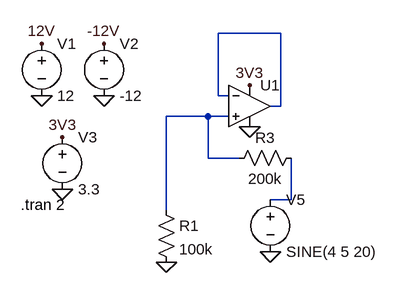
[diagram p0: schematic Draft1.asc]
Draft1.asc, the LTspice schematic file:
Version 4
SHEET 1 880 680
WIRE 288 32 192 32
WIRE 192 128 192 32
WIRE 208 128 192 128
WIRE 288 144 288 32
WIRE 288 144 272 144
WIRE 176 160 112 160
WIRE 208 160 176 160
WIRE 176 224 176 160
WIRE 224 224 176 224
WIRE 304 288 304 224
WIRE 304 288 272 288
WIRE 112 304 112 160
FLAG -80 128 0
FLAG 16 128 0
FLAG -48 272 0
FLAG -80 48 12V
FLAG 16 48 -12V
FLAG -48 192 3V3
FLAG 272 368 0
FLAG 112 384 0
FLAG 240 176 0
FLAG 240 112 3V3
SYMBOL voltage -80 32 R0
WINDOW 123 0 0 Left 0
WINDOW 39 0 0 Left 0
SYMATTR InstName V1
SYMATTR Value 12
SYMBOL voltage 16 32 R0
WINDOW 123 0 0 Left 0
WINDOW 39 0 0 Left 0
SYMATTR InstName V2
SYMATTR Value -12
SYMBOL voltage -48 176 R0
WINDOW 123 0 0 Left 0
WINDOW 39 0 0 Left 0
SYMATTR InstName V3
SYMATTR Value 3.3
SYMBOL Opamps\\UniversalOpamp2 240 144 R0
SYMATTR InstName U1
SYMBOL voltage 272 272 R0
WINDOW 123 0 0 Left 0
WINDOW 39 0 0 Left 0
SYMATTR InstName V5
SYMATTR Value SINE(4 5 20)
SYMBOL res 96 288 R0
SYMATTR InstName R1
SYMATTR Value 100k
SYMBOL res 320 208 R90
WINDOW 0 0 56 VBottom 2
WINDOW 3 32 56 VTop 2
SYMATTR InstName R3
SYMATTR Value 200k
TEXT -112 296 Left 2 !.tran 2

The netlist it stands for:
* Draft1.asc
V1 12V 0 12
V2 -12V 0 -12
V3 3V3 0 3.3
XU1 N002 N001 3V3 0 N001 level.2 Avol=1Meg GBW=10Meg Slew=10Meg ilimit=25m rail=0 Vos=0 phimargin=45 en=0 enk=0 in=0 ink=0 Rin=500Meg  ; pins IN+ IN- V+ V- OUT
V5 N003 0 SINE(4 5 20)
R1 N002 0 100k
R3 N003 N002 200k
.tran 2
.lib UniversalOpamps2.sub
.backanno
.end